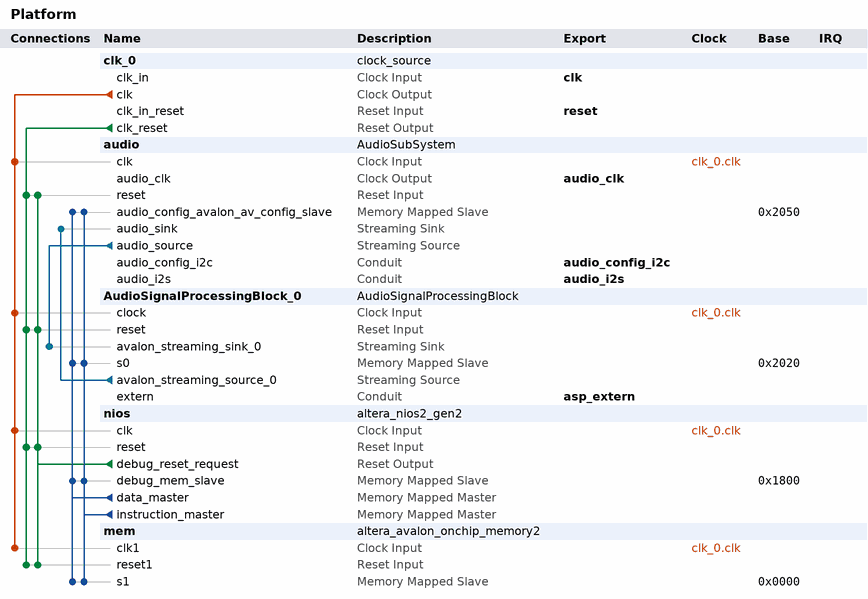
[diagram p0: system contents]
# Platform Designer (Qsys) system Platform, Cyclone V 5CSEMA5F31C6
# Parameters at their usual value, and those the tool derives, are not listed.
package require -exact qsys 16.1
create_system Platform
set_project_property DEVICE_FAMILY {Cyclone V}
set_project_property DEVICE 5CSEMA5F31C6

add_instance clk_0 clock_source 16.1
set_instance_parameter_value clk_0 clockFrequency 50000000

add_instance audio AudioSubSystem 1.0

add_instance AudioSignalProcessingBlock_0 AudioSignalProcessingBlock 1.2
set_instance_parameter_value AudioSignalProcessingBlock_0 gDataWidth 24

add_instance nios altera_nios2_gen2 16.1
set_instance_parameter_value nios dcache_size 2048
set_instance_parameter_value nios exceptionSlave mem.s1
set_instance_parameter_value nios icache_size 4096
set_instance_parameter_value nios impl Tiny
set_instance_parameter_value nios resetSlave mem.s1

add_instance mem altera_avalon_onchip_memory2 16.1
set_instance_parameter_value mem dataWidth 32
set_instance_parameter_value mem dualPort false
set_instance_parameter_value mem initMemContent true
set_instance_parameter_value mem initializationFileName onchip_mem.hex
set_instance_parameter_value mem memorySize 4096

# connections
add_connection clk_0.clk audio.clk clock
add_connection clk_0.clk AudioSignalProcessingBlock_0.clock clock
add_connection clk_0.clk mem.clk1 clock
add_connection clk_0.clk nios.clk clock
add_connection clk_0.clk_reset audio.reset reset
add_connection clk_0.clk_reset AudioSignalProcessingBlock_0.reset reset
add_connection clk_0.clk_reset mem.reset1 reset
add_connection clk_0.clk_reset nios.reset reset
add_connection nios.debug_reset_request audio.reset reset
add_connection nios.debug_reset_request AudioSignalProcessingBlock_0.reset reset
add_connection nios.debug_reset_request mem.reset1 reset
add_connection nios.debug_reset_request nios.reset reset
add_connection nios.data_master audio.audio_config_avalon_av_config_slave avalon
set_connection_parameter_value nios.data_master/audio.audio_config_avalon_av_config_slave baseAddress 0x2050
add_connection nios.data_master AudioSignalProcessingBlock_0.s0 avalon
set_connection_parameter_value nios.data_master/AudioSignalProcessingBlock_0.s0 baseAddress 0x2020
add_connection nios.data_master mem.s1 avalon
set_connection_parameter_value nios.data_master/mem.s1 baseAddress 0x0000
add_connection nios.data_master nios.debug_mem_slave avalon
set_connection_parameter_value nios.data_master/nios.debug_mem_slave baseAddress 0x1800
add_connection nios.instruction_master audio.audio_config_avalon_av_config_slave avalon
set_connection_parameter_value nios.instruction_master/audio.audio_config_avalon_av_config_slave baseAddress 0x2050
add_connection nios.instruction_master AudioSignalProcessingBlock_0.s0 avalon
set_connection_parameter_value nios.instruction_master/AudioSignalProcessingBlock_0.s0 baseAddress 0x2020
add_connection nios.instruction_master mem.s1 avalon
set_connection_parameter_value nios.instruction_master/mem.s1 baseAddress 0x0000
add_connection nios.instruction_master nios.debug_mem_slave avalon
set_connection_parameter_value nios.instruction_master/nios.debug_mem_slave baseAddress 0x1800
add_connection audio.audio_source AudioSignalProcessingBlock_0.avalon_streaming_sink_0 avalon_streaming
add_connection AudioSignalProcessingBlock_0.avalon_streaming_source_0 audio.audio_sink avalon_streaming

# exported interfaces
add_interface asp_extern conduit end
set_interface_property asp_extern EXPORT_OF AudioSignalProcessingBlock_0.extern
add_interface audio_clk clock source
set_interface_property audio_clk EXPORT_OF audio.audio_clk
add_interface audio_config_i2c conduit end
set_interface_property audio_config_i2c EXPORT_OF audio.audio_config_i2c
add_interface audio_i2s conduit end
set_interface_property audio_i2s EXPORT_OF audio.audio_i2s
add_interface clk clock sink
set_interface_property clk EXPORT_OF clk_0.clk_in
add_interface reset reset sink
set_interface_property reset EXPORT_OF clk_0.clk_in_reset

set_interconnect_requirement {$system} qsys_mm.clockCrossingAdapter HANDSHAKE
set_interconnect_requirement {$system} qsys_mm.enableEccProtection FALSE
set_interconnect_requirement {$system} qsys_mm.insertDefaultSlave FALSE
set_interconnect_requirement {$system} qsys_mm.maxAdditionalLatency 1

save_system Platform.qsys
